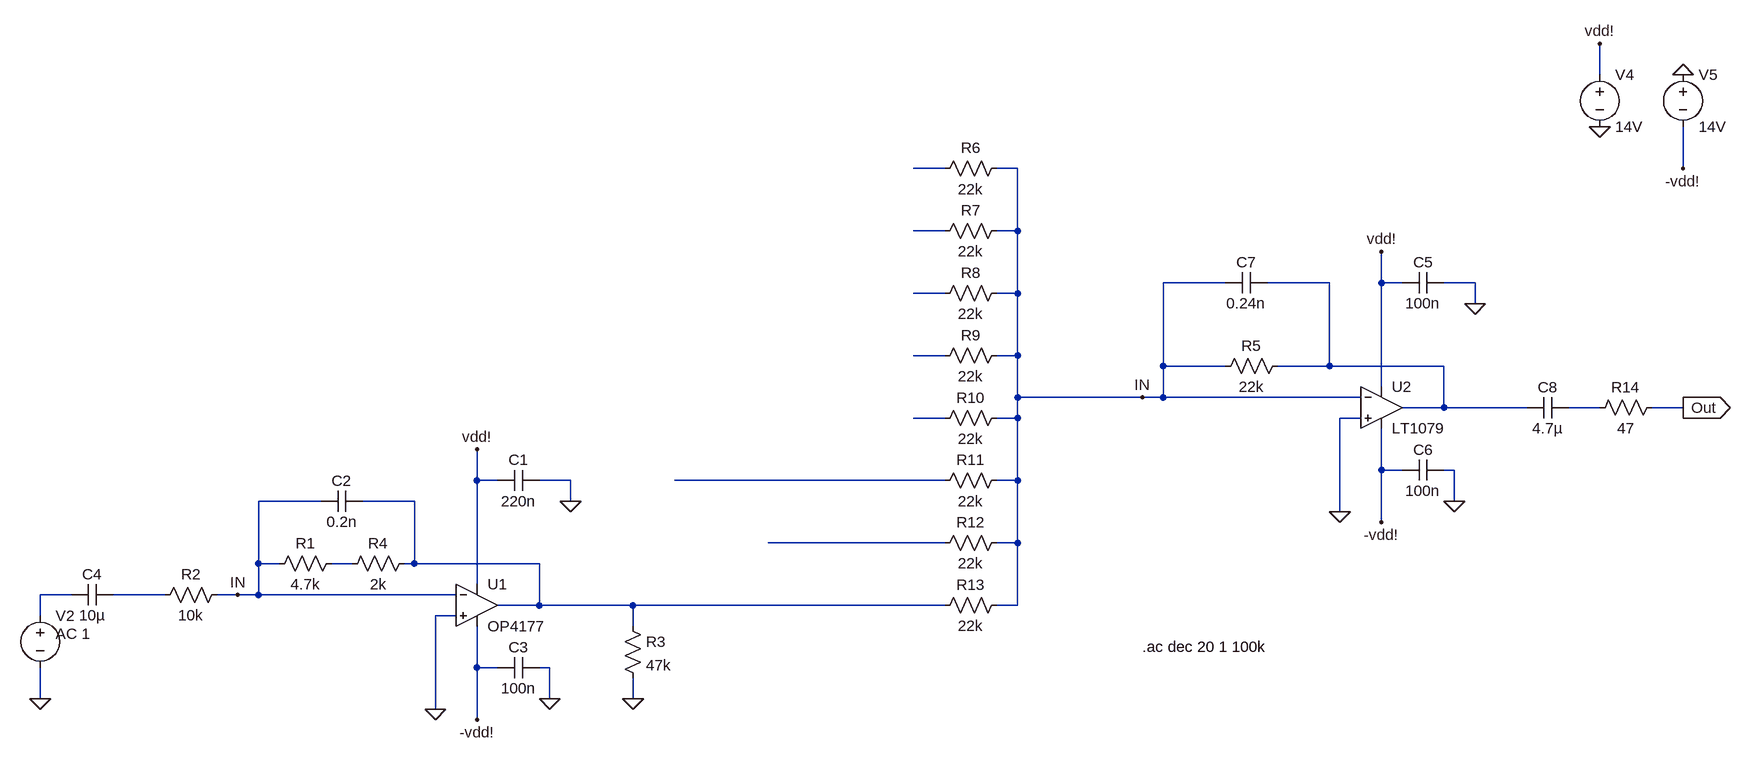
[diagram p0: schematic Mixer.asc]
Mixer.asc, the LTspice schematic file:
Version 4
SHEET 1 3084 680
WIRE 1888 -448 1888 -496
WIRE 880 -304 832 -304
WIRE 992 -304 960 -304
WIRE 2016 -304 2016 -368
WIRE 880 -208 832 -208
WIRE 992 -208 992 -304
WIRE 992 -208 960 -208
WIRE 1312 -128 1216 -128
WIRE 1472 -128 1376 -128
WIRE 1552 -128 1552 -176
WIRE 1584 -128 1552 -128
WIRE 1696 -128 1648 -128
WIRE 880 -112 832 -112
WIRE 992 -112 992 -208
WIRE 992 -112 960 -112
WIRE 1696 -96 1696 -128
WIRE 880 -16 832 -16
WIRE 992 -16 992 -112
WIRE 992 -16 960 -16
WIRE 1216 0 1216 -128
WIRE 1312 0 1216 0
WIRE 1472 0 1472 -128
WIRE 1472 0 1392 0
WIRE 1648 0 1472 0
WIRE 1552 32 1552 -128
WIRE 992 48 992 -16
WIRE 1184 48 992 48
WIRE 1216 48 1216 0
WIRE 1216 48 1184 48
WIRE 1520 48 1216 48
WIRE 1648 64 1648 0
WIRE 1648 64 1584 64
WIRE 1776 64 1648 64
WIRE 1888 64 1840 64
WIRE 2016 64 1968 64
WIRE 880 80 832 80
WIRE 992 80 992 48
WIRE 992 80 960 80
WIRE 1520 80 1488 80
WIRE 1552 160 1552 96
WIRE 1584 160 1552 160
WIRE 1664 160 1648 160
WIRE 160 176 160 128
WIRE 192 176 160 176
WIRE 304 176 256 176
WIRE 880 176 464 176
WIRE 992 176 992 80
WIRE 992 176 960 176
WIRE -80 208 -176 208
WIRE 64 208 -16 208
WIRE 304 208 304 176
WIRE 1664 208 1664 160
WIRE 1488 224 1488 80
WIRE 1552 240 1552 160
WIRE 880 272 608 272
WIRE 992 272 992 176
WIRE 992 272 960 272
WIRE -176 304 -176 208
WIRE -144 304 -176 304
WIRE -32 304 -64 304
WIRE 64 304 64 208
WIRE 64 304 48 304
WIRE 256 304 64 304
WIRE 160 336 160 176
WIRE -464 352 -512 352
WIRE -320 352 -400 352
WIRE -208 352 -240 352
WIRE -176 352 -176 304
WIRE -176 352 -208 352
WIRE 128 352 -176 352
WIRE 256 368 256 304
WIRE 256 368 192 368
WIRE 400 368 256 368
WIRE 880 368 400 368
WIRE 992 368 992 272
WIRE 992 368 960 368
WIRE -512 384 -512 352
WIRE 128 384 96 384
WIRE 400 400 400 368
WIRE 160 464 160 400
WIRE 192 464 160 464
WIRE 272 464 256 464
WIRE -512 512 -512 464
WIRE 272 512 272 464
WIRE 400 512 400 480
WIRE 96 528 96 384
WIRE 160 544 160 464
FLAG 96 528 0
FLAG 304 208 0
FLAG 160 128 vdd!
FLAG -512 512 0
FLAG 160 544 -vdd!
FLAG 272 512 0
FLAG -208 352 IN
FLAG 1488 224 0
FLAG 1696 -96 0
FLAG 1888 -368 0
FLAG 1888 -496 vdd!
FLAG 1552 -176 vdd!
FLAG 2016 -448 0
FLAG 2016 -304 -vdd!
FLAG 1552 240 -vdd!
FLAG 1664 208 0
FLAG 1184 48 IN
FLAG 2016 64 Out
IOPIN 2016 64 Out
FLAG 400 512 0
SYMBOL cap 256 160 R90
WINDOW 0 0 32 VBottom 2
WINDOW 3 32 32 VTop 2
SYMATTR InstName C1
SYMATTR Value 220n
SYMBOL cap -16 192 R90
WINDOW 0 0 32 VBottom 2
WINDOW 3 32 32 VTop 2
SYMATTR InstName C2
SYMATTR Value 0.2n
SYMBOL res -48 288 R90
WINDOW 0 0 56 VBottom 2
WINDOW 3 32 56 VTop 2
SYMATTR InstName R1
SYMATTR Value 4.7k
SYMBOL res -224 336 R90
WINDOW 0 0 56 VBottom 2
WINDOW 3 32 56 VTop 2
SYMATTR InstName R2
SYMATTR Value 10k
SYMBOL res 64 288 R90
WINDOW 0 0 56 VBottom 2
WINDOW 3 32 56 VTop 2
SYMATTR InstName R4
SYMATTR Value 2k
SYMBOL voltage -512 368 R0
WINDOW 3 24 -351 Left 2
WINDOW 123 24 44 Left 2
WINDOW 39 0 0 Left 0
SYMATTR Value ""
SYMATTR InstName V2
SYMATTR Value2 AC 1
SYMBOL Opamps\\OP4177 160 304 R0
SYMATTR InstName U1
SYMBOL cap 256 448 R90
WINDOW 0 0 32 VBottom 2
WINDOW 3 32 32 VTop 2
SYMATTR InstName C3
SYMATTR Value 100n
SYMBOL cap -400 336 R90
WINDOW 0 0 32 VBottom 2
WINDOW 3 32 32 VTop 2
SYMATTR InstName C4
SYMATTR Value 10µ
SYMBOL cap 1648 -144 R90
WINDOW 0 0 32 VBottom 2
WINDOW 3 32 32 VTop 2
SYMATTR InstName C5
SYMATTR Value 100n
SYMBOL res 1408 -16 R90
WINDOW 0 0 56 VBottom 2
WINDOW 3 32 56 VTop 2
SYMATTR InstName R5
SYMATTR Value 22k
SYMBOL voltage 1888 -464 R0
WINDOW 123 0 0 Left 0
WINDOW 39 0 0 Left 0
SYMATTR InstName V4
SYMATTR Value 14V
SYMBOL voltage 2016 -464 R0
WINDOW 123 0 0 Left 0
WINDOW 39 0 0 Left 0
SYMATTR InstName V5
SYMATTR Value 14V
SYMBOL cap 1648 144 R90
WINDOW 0 0 32 VBottom 2
WINDOW 3 32 32 VTop 2
SYMATTR InstName C6
SYMATTR Value 100n
SYMBOL Opamps\\LT1079 1552 0 R0
SYMATTR InstName U2
SYMBOL res 976 -320 R90
WINDOW 0 0 56 VBottom 2
WINDOW 3 32 56 VTop 2
SYMATTR InstName R6
SYMATTR Value 22k
SYMBOL cap 1376 -144 R90
WINDOW 0 0 32 VBottom 2
WINDOW 3 32 32 VTop 2
SYMATTR InstName C7
SYMATTR Value 0.24n
SYMBOL res 976 -224 R90
WINDOW 0 0 56 VBottom 2
WINDOW 3 32 56 VTop 2
SYMATTR InstName R7
SYMATTR Value 22k
SYMBOL res 976 -128 R90
WINDOW 0 0 56 VBottom 2
WINDOW 3 32 56 VTop 2
SYMATTR InstName R8
SYMATTR Value 22k
SYMBOL res 976 -32 R90
WINDOW 0 0 56 VBottom 2
WINDOW 3 32 56 VTop 2
SYMATTR InstName R9
SYMATTR Value 22k
SYMBOL res 976 64 R90
WINDOW 0 0 56 VBottom 2
WINDOW 3 32 56 VTop 2
SYMATTR InstName R10
SYMATTR Value 22k
SYMBOL res 976 160 R90
WINDOW 0 0 56 VBottom 2
WINDOW 3 32 56 VTop 2
SYMATTR InstName R11
SYMATTR Value 22k
SYMBOL res 976 256 R90
WINDOW 0 0 56 VBottom 2
WINDOW 3 32 56 VTop 2
SYMATTR InstName R12
SYMATTR Value 22k
SYMBOL res 976 352 R90
WINDOW 0 0 56 VBottom 2
WINDOW 3 32 56 VTop 2
SYMATTR InstName R13
SYMATTR Value 22k
SYMBOL cap 1840 48 R90
WINDOW 0 0 32 VBottom 2
WINDOW 3 32 32 VTop 2
SYMATTR InstName C8
SYMATTR Value 4.7µ
SYMBOL res 1984 48 R90
WINDOW 0 0 56 VBottom 2
WINDOW 3 32 56 VTop 2
SYMATTR InstName R14
SYMATTR Value 47
SYMBOL res 384 384 R0
SYMATTR InstName R3
SYMATTR Value 47k
TEXT 1184 432 Left 2 !.ac dec 20 1 100k

The netlist it stands for:
* Mixer.asc
C1 0 vdd! 220n
C2 N009 IN 0.2n
R1 N011 IN 4.7k
R2 IN N013 10k
R4 N009 N011 2k
V2 N012 0 AC 1
XU1 0 IN vdd! -vdd! N009 OP4177  ; pins In+ In- V+ V- OUT
C3 0 -vdd! 100n
C4 N013 N012 10µ
C5 0 vdd! 100n
R5 N003 IN 22k
V4 vdd! 0 14V
V5 0 -vdd! 14V
C6 0 -vdd! 100n
XU2 0 IN vdd! -vdd! N003 LT1079  ; pins In+ In- V+ V- OUT
R6 IN N001 22k
C7 N003 IN 0.24n
R7 IN N002 22k
R8 IN N004 22k
R9 IN N005 22k
R10 IN N007 22k
R11 IN N008 22k
R12 IN N010 22k
R13 IN N009 22k
C8 N006 N003 4.7µ
R14 Out N006 47
R3 N009 0 47k
.ac dec 20 1 100k
.backanno
.end